# Altium schematic sheet 02-POWER.SchDoc
size A
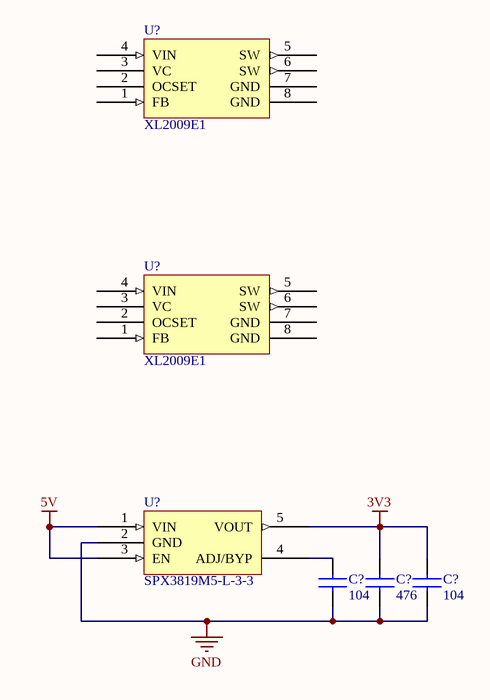
[diagram p0: 02-POWER.SchDoc]

## Parts
(Parts that share a designator on the sheet are numbered #1, #2 ... from top to bottom, then left to right.)
C?#1  104  [C0603]
C?#2  476  [C0805]
C?#3  104  [C0603]
U?#1  XL2009E1  [SOIC-8]
U?#2  XL2009E1  [SOIC-8]
U?#3  SPX3819M5-L-3-3  [SOT-23-5]

## Nets
3V3: C?#2.1 C?#3.1 U?#3.5(VOUT)
5V: U?#3.1(VIN) U?#3.3(EN)
GND: C?#1.2 C?#2.2 C?#3.2 U?#3.2(GND)
NetC?#1_1: C?#1.1 U?#3.4(ADJ/BYP)

Not connected (* = marked no-connect by the designer): U?#1 1(FB) 2(OCSET) 3(VC) 4(VIN) 5(SW) 6(SW) 7(GND) 8(GND); U?#2 1(FB) 2(OCSET) 3(VC) 4(VIN) 5(SW) 6(SW) 7(GND) 8(GND)

## Library data of the parts
C?#1-C?#3 = C: 电容; Coding: 41170010
U?#1 U?#2 = XL2009E1: VIN->12V->5V
U?#3 = SPX3819M5-L-3-3: 5V->3.3V